# EAGLE design HV Board rev10 (EAGLE 9.2.2)
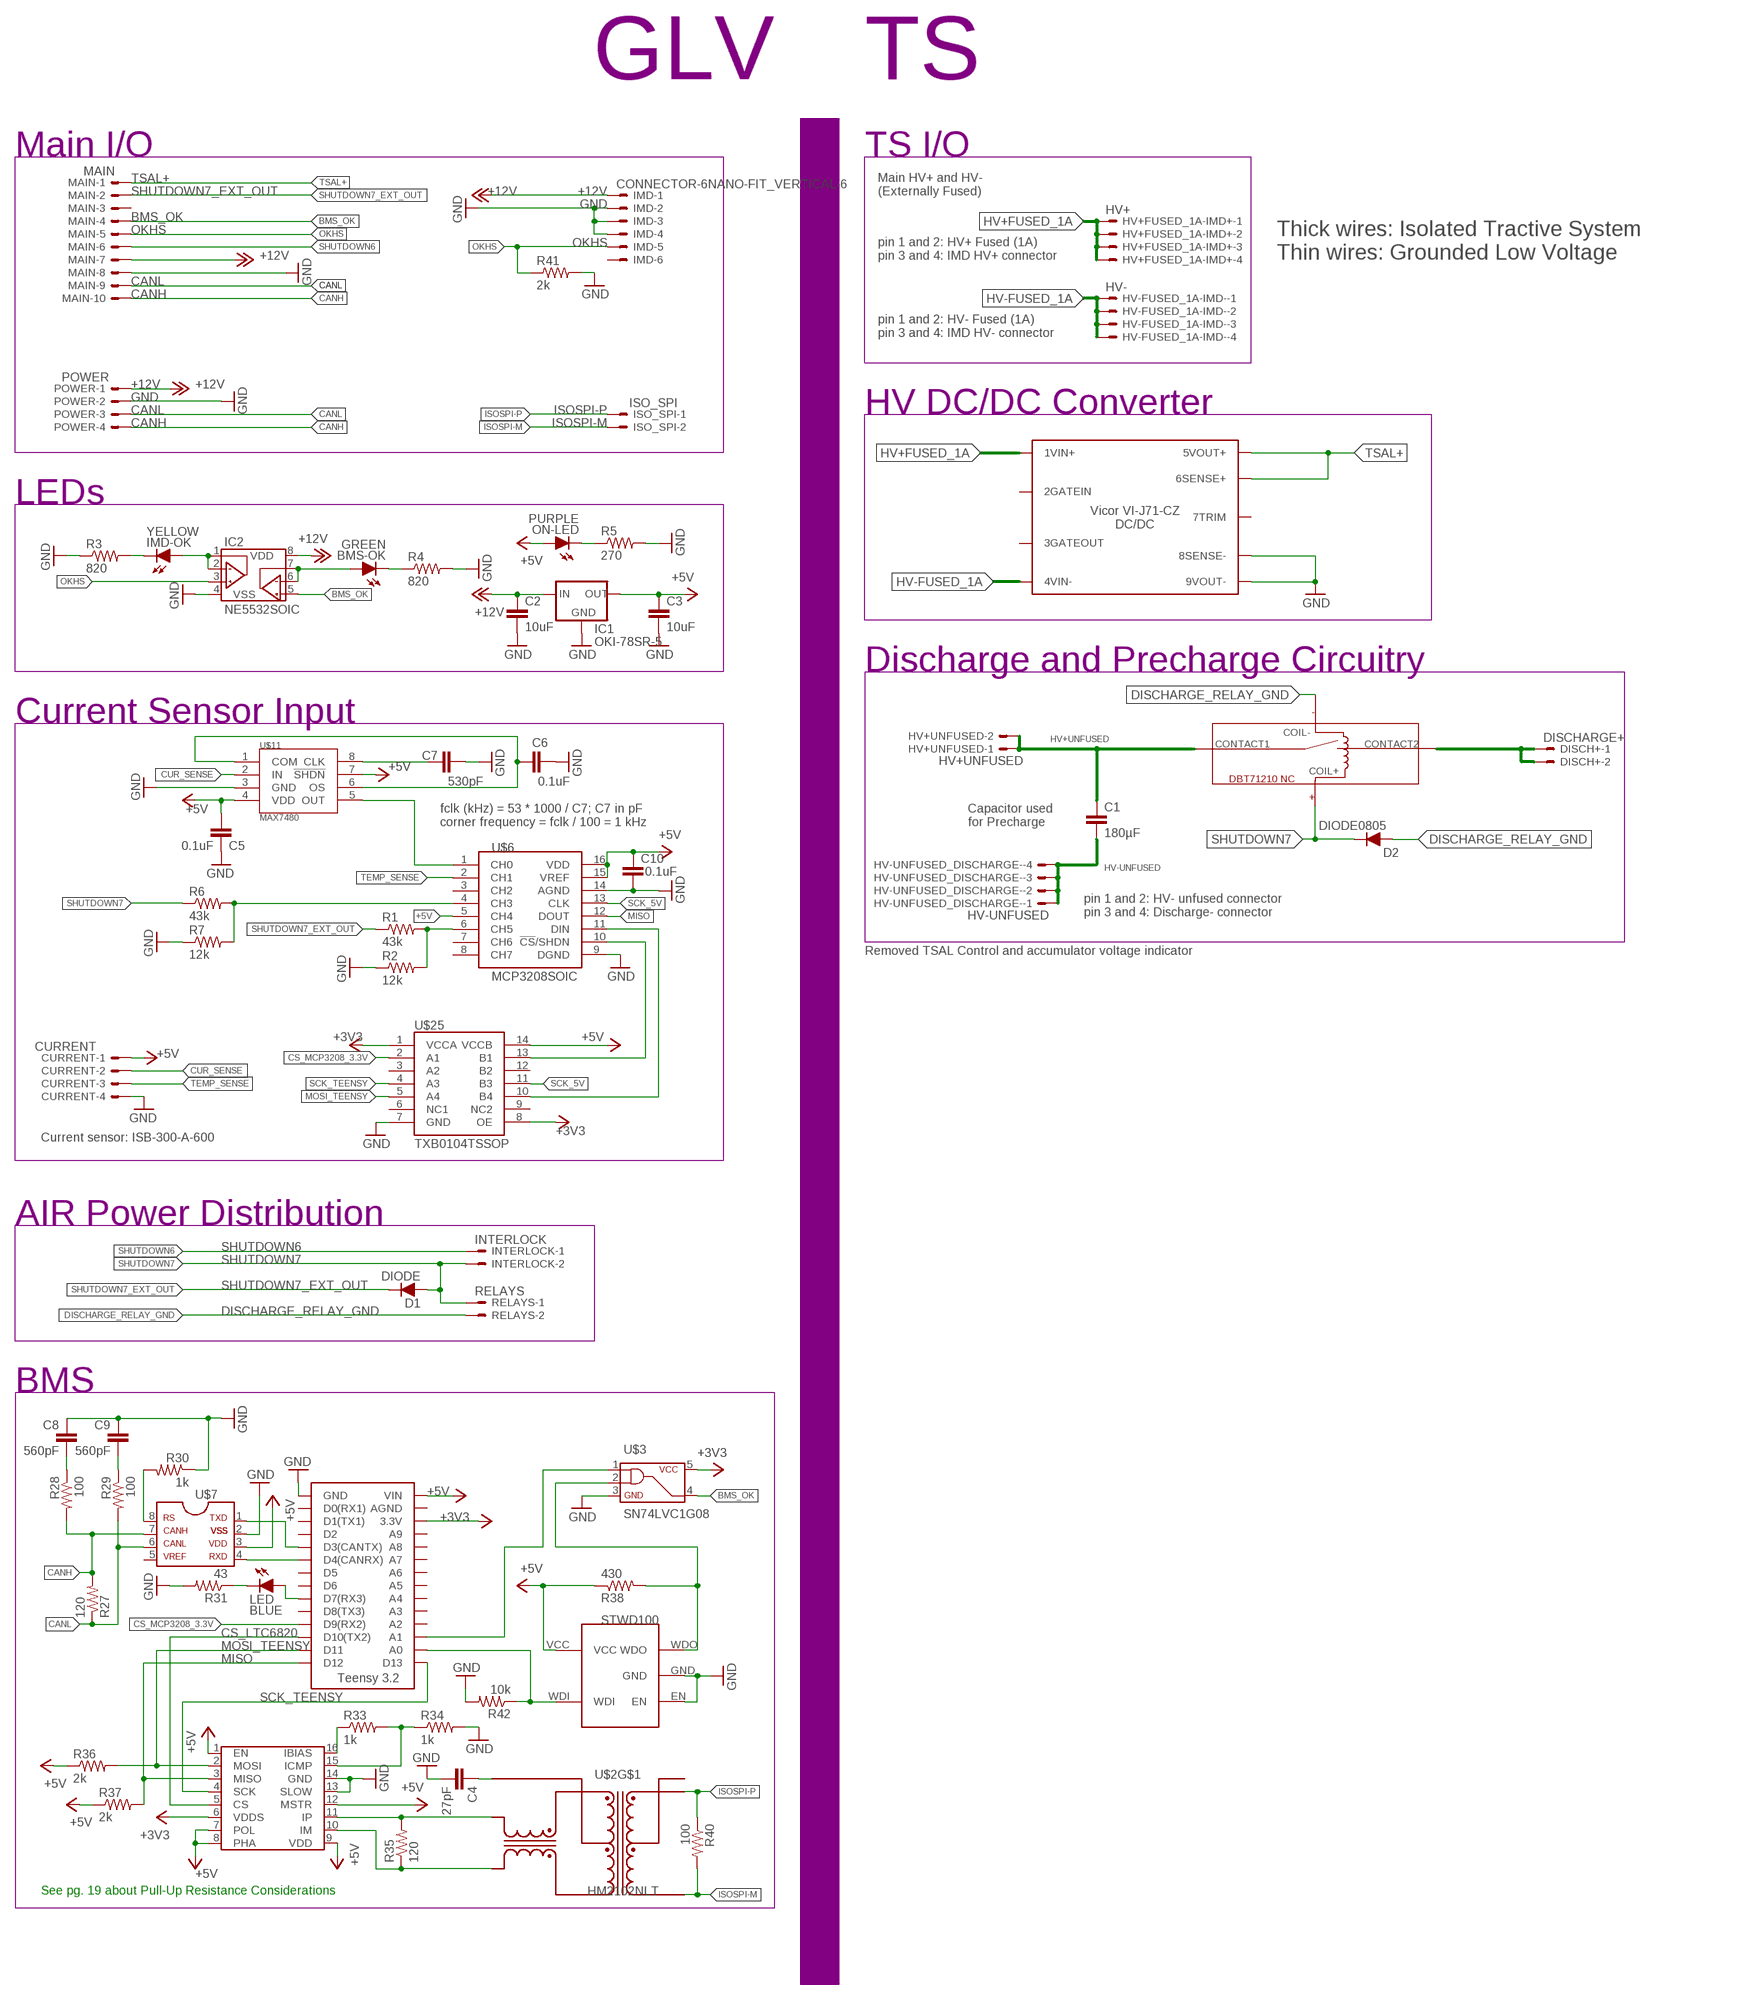
[diagram p0: schematic, sheet 1]

## Parts
BMS-OK  GREEN  LED-0805  [LED-805]
C1  180µF  CAP  [LLS2V221MELZ]
C2  10uF  CAP0805  [0805]
C3  10uF  CAP0805  [0805]
C4  27pF  CAP0805  [0805]
C5  0.1uF  CAP0805  [0805]
C6  0.1uF  CAP0805  [0805]
C7  530pF  CAP0805  [0805]
C8  560pF  CAP0805  [0805]
C9  560pF  CAP0805  [0805]
C10  0.1uF  CAP0805  [0805]
CURRENT  CURRENT  CONNECTOR-4NANO-FIT-VERTICAL-4  [NANO-FIT_VERTICAL-4]
D1  DIODE  DIODEDO-41  [DO-41]
D2  DIODE0805  [0805_D]
DISCH+  DISCHARGE+  CONNECTOR-2NANO-FIT_VERTICAL-2  [NANO-FIT_VERTICAL-2]
HV+FUSED_1A-IMD+  HV+  CONNECTOR-4NANO-FIT-VERTICAL-4  [NANO-FIT_VERTICAL-4]
HV+UNFUSED  HV+UNFUSED  CONNECTOR-2NANO-FIT_VERTICAL-2  [NANO-FIT_VERTICAL-2]
HV-FUSED_1A-IMD-  HV-  CONNECTOR-4NANO-FIT-VERTICAL-4  [NANO-FIT_VERTICAL-4]
HV-UNFUSED_DISCHARGE-  HV-UNFUSED  CONNECTOR-4NANO-FIT-VERTICAL-4  [NANO-FIT_VERTICAL-4]
IC1  OKI-78SR-5  [OKI-78SR]
IC2  NE5532SOIC  [SOIC-08]
IMD  CONNECTOR-6NANO-FIT_VERTICAL-6  [NANO-FIT_VERTICAL-6]
IMD-OK  YELLOW  LED-0805  [LED-805]
INTERLOCK  INTERLOCK  CONNECTOR-2NANO-FIT_VERTICAL-2  [NANO-FIT_VERTICAL-2]
ISO_SPI  ISO_SPI  CONNECTOR-2NANO-FIT_VERTICAL-2  [NANO-FIT_VERTICAL-2]
LED  BLUE  LED-0805  [LED-805]
MAIN  MAIN  CONNECTOR-10NANO-FIT_VERTICAL-10  [NANO-FIT_VERTICAL-10]
ON-LED  PURPLE  LED-0805  [LED-805]
POWER  POWER  CONNECTOR-4NANO-FIT-VERTICAL-4  [NANO-FIT_VERTICAL-4]
R1  43k  RESISTOR0805-RES  [0805]
R2  12k  RESISTOR0805-RES  [0805]
R3  820  RESISTOR0805-RES  [0805]
R4  820  RESISTOR0805-RES  [0805]
R5  270  RESISTOR0805-RES  [0805]
R6  43k  RESISTOR0805-RES  [0805]
R7  12k  RESISTOR0805-RES  [0805]
R27  120  RESISTOR0805-RES  [0805]
R28  100  RESISTOR0805-RES  [0805]
R29  100  RESISTOR0805-RES  [0805]
R30  1k  RESISTOR0805-RES  [0805]
R31  43  RESISTOR0805-RES  [0805]
R33  1k  RESISTOR0805-RES  [0805]
R34  1k  RESISTOR0805-RES  [0805]
R35  120  RESISTOR0805-RES  [0805]
R36  2k  RESISTOR0805-RES  [0805]
R37  2k  RESISTOR0805-RES  [0805]
R38  430  RESISTOR0805-RES  [0805]
R40  100  RESISTOR0805-RES  [0805]
R41  2k  RESISTOR0805-RES  [0805]
R42  10k  RESISTOR0805-RES  [0805]
RELAYS  RELAYS  CONNECTOR-2NANO-FIT_VERTICAL-2  [NANO-FIT_VERTICAL-2]
U$2  HM2102NLT  [HM2102NLT]
U$3  SN74LVC1G08  [SOT-23-5]
U$4  DBT71210  [DBT71210]
U$5  HV_DCDC_VI-J71-CZ  [HV_DCDC_VI-J71-CZ]
U$6  MCP3208SOIC  [SOIC-16]
U$7  MCP2551  [SOIC-08]
U$8  LTC6820  [MSOP-16]
U$9  TEENSY_3.2_SIMPLE  [TEENSY_3.2_SIMPLE]
U$10  STWD100  [SOT23-5]
U$11  MAX7480  [SOIC-08]
U$25  TXB0104TSSOP  [TSSOP-14]

## Nets
+3V3: U$3.5 U$8.6(VDDS) U$9.3.3V U$25.1(VCCA) U$25.8(OE)
+5V: C3.1 C5.1 C10.1 CURRENT.P$1 IC1.3(OUT) ON-LED.A R36.1 R37.1 R38.1 U$6.5(CH4) U$6.15(VREF) U$6.16(VDD) U$7.3 U$8.1(EN) U$8.7(POL) U$8.8(PHA) U$8.9(VDD) U$8.12(MSTR) U$9.VIN U$10.VCC U$11.4(VDD) U$25.14(VCCB)
+12V: C2.1 IC1.1(IN) IC2.8(VDD) IMD.P$1 MAIN.P$7 POWER.P$1
BMS_OK: IC2.5(VINB+) MAIN.P$4 U$3.4
CANH: MAIN.P$10 POWER.P$4 R27.2 R28.2 U$7.7
CANL: MAIN.P$9 POWER.P$3 R27.1 R29.2 U$7.6
CS_LTC6820: U$8.5(CS) U$9.D10(TX2)
CS_MCP3208_3.3V: U$9.D9(RX2) U$25.2(A1)
CUR_SENSE: CURRENT.P$2 U$11.2(IN)
DISCHARGE_RELAY_GND: D2.A RELAYS.P$2 U$4.COIL-
GND: C2.2 C3.2 C4.2 C5.2 C6.2 C7.2 C8.1 C9.1 C10.2 CURRENT.P$4 IC1.2(GND) IC2.4(VSS) IMD.P$2 IMD.P$3 IMD.P$4 MAIN.P$8 POWER.P$2 R2.1 R3.1 R4.2 R5.2 R7.1 R30.1 R31.2 R34.2 R41.2 R42.2 U$3.3 U$5.8SENSE- U$5.9VOUT- U$6.9(DGND) U$6.14(AGND) U$7.2 U$8.13(SLOW) U$8.14(GND) U$9.GND U$10.EN U$10.GND U$11.3(GND) U$25.7(GND)
HV+FUSED_1A [TS]: HV+FUSED_1A-IMD+.P$1 HV+FUSED_1A-IMD+.P$2 HV+FUSED_1A-IMD+.P$3 HV+FUSED_1A-IMD+.P$4 U$5.1VIN+
HV+UNFUSED [TS]: C1.P$1 HV+UNFUSED.P$1 HV+UNFUSED.P$2 U$4.CONTACT1
HV+UNFUSED_FSAE_DISCHARGE [TS]: DISCH+.P$1 DISCH+.P$2 U$4.CONTACT2
HV-FUSED_1A [TS]: HV-FUSED_1A-IMD-.P$1 HV-FUSED_1A-IMD-.P$2 HV-FUSED_1A-IMD-.P$3 HV-FUSED_1A-IMD-.P$4 U$5.4VIN-
HV-UNFUSED [TS]: C1.P$2 HV-UNFUSED_DISCHARGE-.P$1 HV-UNFUSED_DISCHARGE-.P$2 HV-UNFUSED_DISCHARGE-.P$3 HV-UNFUSED_DISCHARGE-.P$4
IM: R35.1 U$2.P$10(TD-) U$8.10(IM)
IP: R35.2 U$2.P$12(TD+) U$8.11(IP)
ISOSPI-M [ISO_SPI]: ISO_SPI.P$2 R40.2 U$2.P$3(MX-)
ISOSPI-P [ISO_SPI]: ISO_SPI.P$1 R40.1 U$2.P$1(MX+)
MISO: R37.2 U$6.12(DOUT) U$8.3(MISO) U$9.D12
MOSI_5V: U$6.11(DIN) U$25.10(B4)
MOSI_TEENSY: R36.2 U$8.2(MOSI) U$9.D11 U$25.5(A4)
N$1: U$6.1(CH0) U$11.5(OUT)
N$2: C6.1 U$11.1(COM) U$11.6(OS)
N$3: ON-LED.C R5.1
N$4: C7.1 U$11.8(CLK)
N$7: U$6.10(!CS!/SHDN) U$25.13(B1)
N$8: U$11.7(!SHDN) ; supply symbol labelled +5V
N$9: R6.2 R7.2 U$6.4(CH3)
N$24: R1.2 R2.2 U$6.6(CH5)
N$25: U$7.1 U$9.D3(CANTX)
N$26: R30.2 U$7.8
N$27: C8.2 R28.1
N$28: C9.2 R29.1
N$29: LED.C R31.1
N$31: R33.1 U$8.16(IBIAS)
N$32: R33.2 R34.1 U$8.15(ICMP)
N$35: C4.1 U$2.P$11(TCT)
N$36: U$7.4 U$9.D4(CANRX)
N$37: LED.A U$9.D7(RX3)
N$38: R38.2 U$3.2 U$10.WDO
N$40: U$3.1 U$9.A1
N$42: IC2.1(VOUTA) IC2.2(VINA-) IMD-OK.A
N$43: BMS-OK.A IC2.6(VINB-) IC2.7(VOUTB)
N$44: BMS-OK.C R4.1
N$45: IMD-OK.C R3.2
N$50: R42.1 U$9.A0 U$10.WDI
OKHS: IC2.3(VINA+) IMD.P$5 MAIN.P$5 R41.1
SCK_5V: U$6.13(CLK) U$25.11(B3)
SCK_TEENSY: U$8.4(SCK) U$9.D13 U$25.4(A3)
SHUTDOWN6: INTERLOCK.P$1 MAIN.P$6
SHUTDOWN7: D1.A D2.C INTERLOCK.P$2 R6.1 RELAYS.P$1 U$4.COIL+
SHUTDOWN7_EXT_OUT: D1.C MAIN.P$2 R1.1
TEMP_SENSE: CURRENT.P$3 U$6.2(CH1)
TSAL+: MAIN.P$1 U$5.5VOUT+ U$5.6SENSE+
Unconnected: IMD.P$6 MAIN.P$3 U$2.P$2(MCT) U$2.P$4(MX+) U$2.P$5(MCT) U$2.P$6(MX-) U$2.P$7(TD-) U$2.P$8(TCT) U$2.P$9(TD+) U$5.2GATEIN U$5.3GATEOUT U$5.7TRIM U$6.3(CH2) U$6.7(CH6) U$6.8(CH7) U$7.5 U$9.A2 U$9.A3 U$9.A4 U$9.A5 U$9.A6 U$9.A7 U$9.A8 U$9.A9 U$9.AGND U$9.D0(RX1) U$9.D1(TX1) U$9.D2 U$9.D5 U$9.D6 U$9.D8(TX3) U$25.3(A2) U$25.6(NC1) U$25.9(NC2) U$25.12(B2)

## Notes on the sheet
- GLV
- TS
- Main I/O | TS I/O
- Main HV+ and HV-
  (Externally Fused)
- pin 1 and 2: HV+ Fused (1A)
  pin 3 and 4: IMD HV+ connector
- Thick wires: Isolated Tractive System
  Thin wires: Grounded Low Voltage
- pin 1 and 2: HV- Fused (1A)
  pin 3 and 4: IMD HV- connector
- HV DC/DC Converter
- LEDs
- Discharge and Precharge Circuitry
- Current Sensor Input
- fclk (kHz) = 53 * 1000 / C7; C7 in pF
  corner frequency = fclk / 100 = 1 kHz
- Capacitor used
  for Precharge
- pin 1 and 2: HV- unfused connector
  pin 3 and 4: Discharge- connector
- Removed TSAL Control and accumulator voltage indicator
- Current sensor: ISB-300-A-600
- AIR Power Distribution
- BMS
- See pg. 19 about Pull-Up Resistance Considerations

## Library data of the parts
BMS-OK IMD-OK LED ON-LED = HyTechDevices:LED: Light Emitting Diode (LED) Source: Dangerous Prototypes Eagle Library <https://github.com/DangerousPrototypes/Eagle_Part_Library>
C1-C10 = HyTechDevices:CAP: Capacitor Standard 0603 ceramic capacitor, and 0.1" leaded capacitor.
CURRENT HV+FUSED_1A-IMD+ HV-FUSED_1A-IMD- HV-UNFUSED_DISCHARGE- POWER = HyTechDevices:CONNECTOR-4: Mini-Fit Junior connector 4 pole Source: http://www.molex.com
D1 D2 = HyTechDevices:DIODE: DIODE general purpose rectifier
DISCH+ HV+UNFUSED INTERLOCK ISO_SPI RELAYS = HyTechDevices:CONNECTOR-2: Mini-Fit Junior connector 2 pole Source: http://www.molex.com
IC1 = HyTechDevices:OKI-78SR-5: Murata OKI-78SR 5V 1.5A Non-Isolated Switching Regulator DC/DC - Datasheet <https://power.murata.com/data/power/oki-78sr.pdf>
IC2 = HyTechDevices:NE5532: TI NE5532 Dual Channel Op Amp
IMD = HyTechDevices:CONNECTOR-6: Mini-Fit Junior connector 6 pole Source: http://www.molex.com
MAIN = HyTechDevices:CONNECTOR-10: Mini-Fit Junior connector 10 pole Source: http://www.molex.com
R1-R7 R27-R31 R33-R38 R40-R42 = HyTechDevices:RESISTOR: Resistor Basic schematic elements and footprints for 0603, 1206, and PTH resistors.
U$2 = HyTechDevices:HM2102NLT: 2 Channel SMT Transformer Turns ratio: 1CT: 1CT Isolation Voltage: 4300 VDC Inductance: 150 uH Leakage Inductance: 0.50 uH max DataSheet <https://www.mouser.com/datasheet/2/336/HM2102NL-1218600.pdf>
U$3 = HyTechDevices:SN74LVC1G08: TI SN74LVC1G08 SINGLE 2-INPUT POSITIVE-AND GATE Datasheet <http://www.ti.com/lit/ds/sces556f/sces556f.pdf>
U$4 = HyTechDevices:DBT71210: DBT71210 Reed Relay Form B (Standard normally closed), switch 12V
U$5 = HyTechDevices:HV_DCDC_VI-J71-CZ: Vicor-Corporation VI-J71-CZ Product Page <https://www.digikey.com/product-detail/en/vicor-corporation/VI-J71-CZ/1102-1486-ND/2996194> Datasheet <http://cdn.vicorpower.com/documents/datasheets/ds_vi-j00.pdf>
U$6 = HyTechDevices:MCP3208: Analog to Digital Converter
U$7 = HyTechDevices:MCP2551: MCP2551 High-Speed CAN Transceiver Product Webpage <https://www.microchip.com/wwwproducts/en/MCP2551> Datasheet <http://ww1.microchip.com/downloads/en/DeviceDoc/21667f.pdf> This device is outdated It is replaced by MCP2561. Comparison Page <https://www.microchip.com/wwwproducts/ProductCompare/MCP2551/MCP2561> Product Webpage <https://www.microchip.com/wwwproducts/en/MCP2561> Datasheet <http://ww1.microchip.com/downloads/en/DeviceDoc/20005167C.pdf>
U$8 = HyTechDevices:LTC6820: Linear Technology isoSPI Isolated Communications Interface Datasheet <http://cds.linear.com/docs/en/datasheet/6820fb.pdf>
U$9 = HyTechDevices:TEENSY_3.2_SIMPLE: Simple version of the Teensy 3.2 board that only uses the 2 main rows of pins, not the inner pins or the pins opposite the usb port.
U$10 = HyTechDevices:STWD100: STWD100 Watchdog timer
U$11 = HyTechDevices:MAX7480: 8th-order lowpass butterworth filter
U$25 = HyTechDevices:TXB0104: Texas Instruments TXB0104 4-channel low voltage to high voltage Logic Level Shifter. Minimum input voltage level 1.8V. Maximum output voltage level 5.5V.

## Net classes
1 TS: clearance 8.5 mm to class 0
2 ISO_SPI: clearance 8.5 mm to class 0, clearance 8.5 mm to class 1

## Board
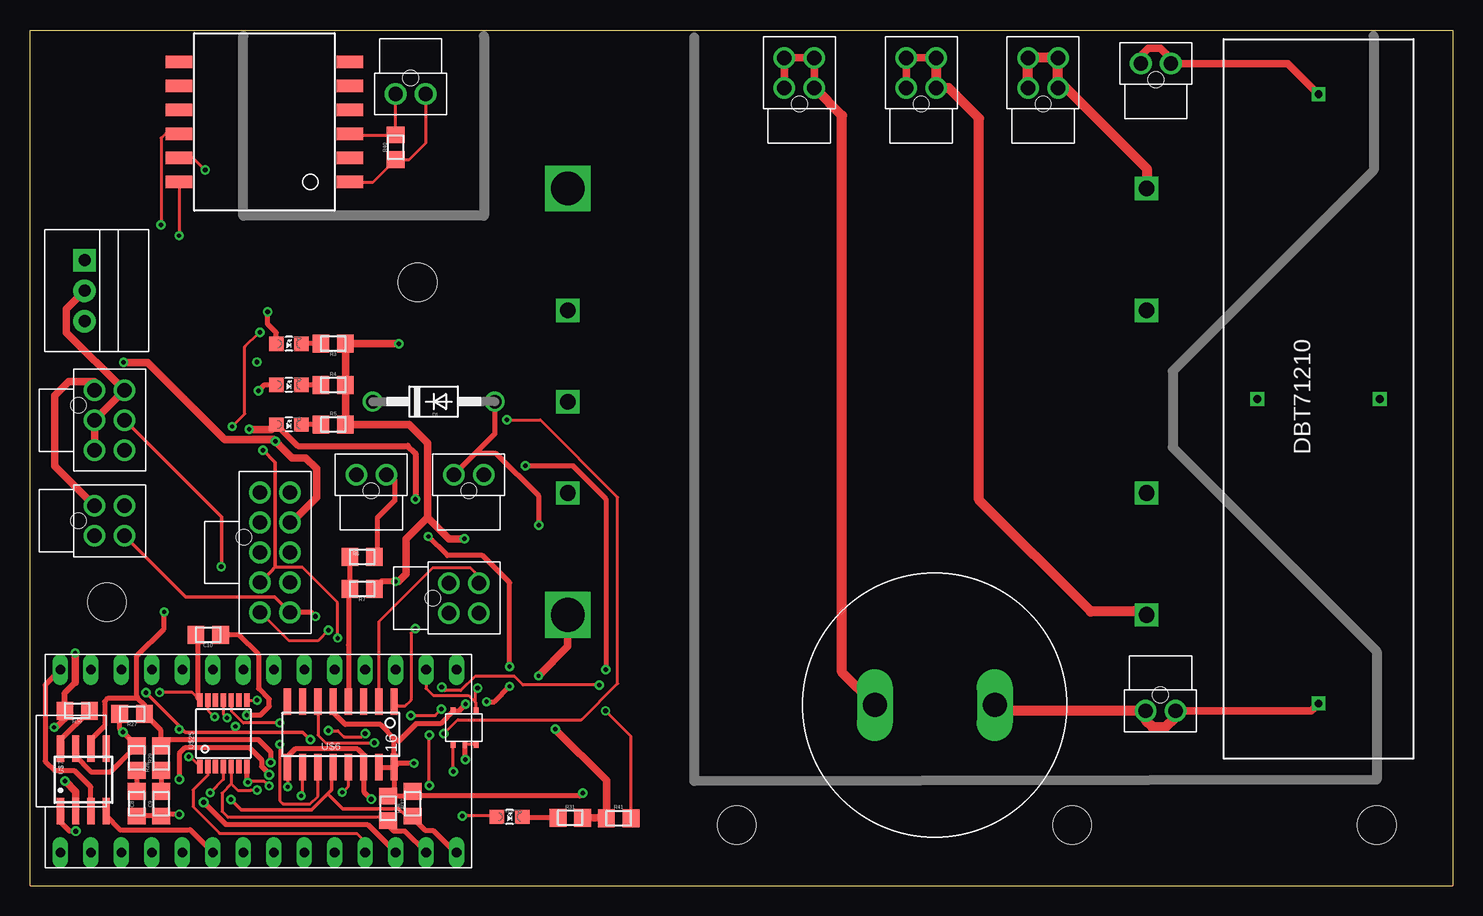
[diagram p1: board, top side]
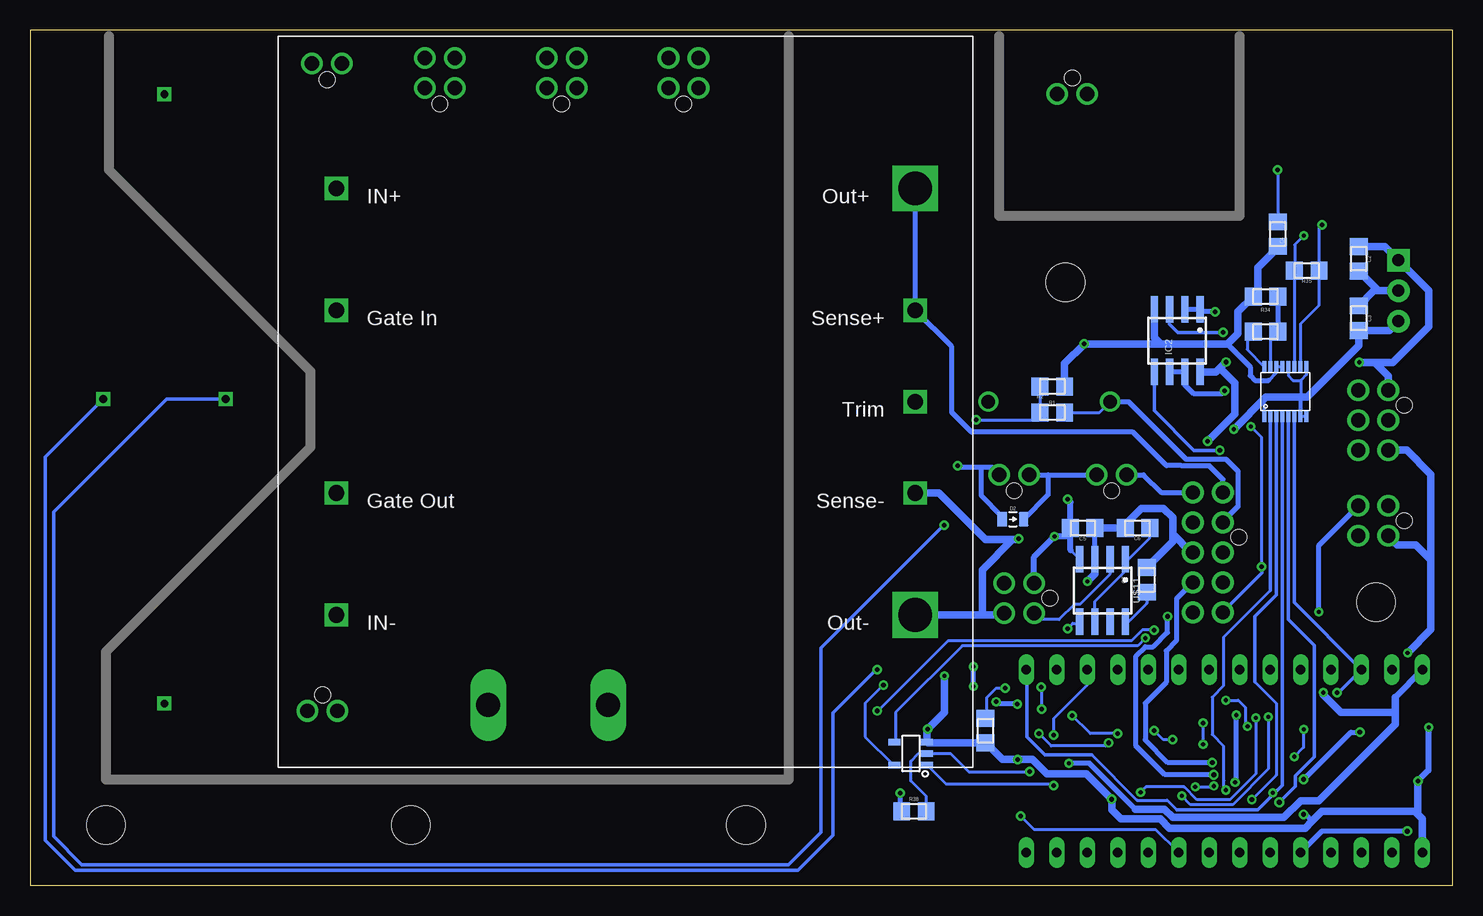
[diagram p2: board, bottom side, seen from below]

Size 118.62 x 71.37 mm. Coordinates in mm from the lower left corner, seen from the top.
Outline: 0,0 118.62,0 118.62,71.37 0,71.37 0,0
Copper layers (1*16): Top 0.035mm / dielectric 1.5mm / Bottom 0.035mm
Design rules "DRC Advanced Circuits": minimum track width 6mil, minimum drill 10mil, track to track 6mil, track to pad 6mil, pad to pad 6mil, via to via 6mil, smd to smd 6mil, copper to edge 40mil, drill to drill 6mil, minimum pad ring 10mil, minimum via ring 8mil, stop-mask expansion 4mil, vias tented up to drill 0mil, thermal gap 10mil
Holes 3.2 mm at 86.87,5.08 6.4,23.67 112.27,5.08 58.93,5.08 32.31,50.34

### Footprints (pad centres in the part's own frame; a part is rotated, then mirrored left to right if it is on the bottom)
LED-805 = smd 1.2 x 1.2: A 0,-1.05; C 0,1.05
LLS2V221MELZ = drill 2 long: P$1 -5,0; P$2 5,0
0805 = smd 1.4 x 1.5: 1 -1.025,0; 2 1.025,0
NANO-FIT_VERTICAL-4 = drill 1.2: P$1 -1.25,0; P$2 1.25,0; P$3 -1.25,2.5; P$4 1.25,2.5 | hole 1.3: 0,-1.34
DO-41 = drill 1.118: A 5.08,0; C -5.08,0
0805_D = smd 0.8 x 1.2: A -0.9,0; C 0.9,0
NANO-FIT_VERTICAL-2 = drill 1.2: P$1 -1.25,0; P$2 1.25,0 | hole 1.3: 0,-1.34
OKI-78SR = drill 1 pad 1.88 square: 1 -2.54,0 | drill 1 pad 1.88: 2 0,0; 3 2.54,0
SOIC-08 = smd 0.6 x 2.2: 1 -1.905,-2.6; 2 -0.635,-2.6; 3 0.635,-2.6; 4 1.905,-2.6; 5 1.905,2.6; 6 0.635,2.6; 7 -0.635,2.6; 8 -1.905,2.6
NANO-FIT_VERTICAL-6 = drill 1.2: P$1 -2.5,0; P$2 0,0; P$3 2.5,0; P$4 -2.5,2.5; P$5 0,2.5; P$6 2.5,2.5 | hole 1.3: -1.25,-1.34
NANO-FIT_VERTICAL-10 = drill 1.2: P$1 -5,0; P$2 -2.5,0; P$3 0,0; P$4 2.5,0; P$5 5,0; P$6 -5,2.5; P$7 -2.5,2.5; P$8 0,2.5; P$9 2.5,2.5; P$10 5,2.5 | hole 1.3: -1.27,-1.34
HM2102NLT = smd 1.067 x 2.184: P$1 0,0; P$2 2,0; P$3 4,0; P$4 6,0; P$5 8,0; P$6 10,0; P$7 10,14.25; P$8 8,14.25; P$9 6,14.25; P$10 4,14.25; P$11 2,14.25; P$12 0,14.25
SOT-23-5 = smd 1 x 0.55: 1 -1.35,0.95; 2 -1.35,0; 3 -1.35,-0.95; 4 1.35,-0.95; 5 1.35,0.95
DBT71210 = drill 0.65 square: COIL+ 30,-13; COIL- 30,-2.8; CONTACT1 55.4,-7.9; CONTACT2 4.6,-7.9
HV_DCDC_VI-J71-CZ = drill 1.3 square: 1VIN+ 5.08,-12.7; 2GATEIN 5.08,-22.86; 3GATEOUT 5.08,-38.1; 4VIN- 5.08,-48.26; 6SENSE+ 53.34,-22.86; 7TRIM 53.34,-30.48; 8SENSE- 53.34,-38.1 | drill 2.8 square: 5VOUT+ 53.34,-12.7; 9VOUT- 53.34,-48.26
SOIC-16 = smd 0.6 x 2.2: 1 -4.445,-2.794; 2 -3.175,-2.794; 3 -1.905,-2.794; 4 -0.635,-2.794; 5 0.635,-2.794; 6 1.905,-2.794; 7 3.175,-2.794; 8 4.445,-2.794; 9 4.445,2.667; 10 3.175,2.667; 11 1.905,2.667; 12 0.635,2.667; 13 -0.635,2.667; 14 -1.905,2.667; 15 -3.175,2.667; 16 -4.445,2.667
MSOP-16 = smd 0.305 x 0.889: 1 -0.1,-0.5; 2 0.4,-0.5; 3 0.9,-0.5; 4 1.4,-0.5; 5 1.9,-0.5; 6 2.4,-0.5; 7 2.9,-0.5; 8 3.4,-0.5; 9 3.4,3.7; 10 2.9,3.7; 11 2.4,3.7; 12 1.9,3.7; 13 1.4,3.7; 14 0.9,3.7; 15 0.4,3.7; 16 -0.1,3.7
TEENSY_3.2_SIMPLE = drill 0.8 long: 3.3V 16.51,29.21; A0 16.51,3.81; A1 16.51,6.35; A2 16.51,8.89; A3 16.51,11.43; A4 16.51,13.97; A5 16.51,16.51; A6 16.51,19.05; A7 16.51,21.59; A8 16.51,24.13; A9 16.51,26.67; AGND 16.51,31.75; D0(RX1) 1.27,31.75; D1(TX1) 1.27,29.21; D2 1.27,26.67; D3(CANTX) 1.27,24.13; D4(CANRX) 1.27,21.59; D5 1.27,19.05; D6 1.27,16.51; D7(RX3) 1.27,13.97; D8(TX3) 1.27,11.43; D9(RX2) 1.27,8.89; D10(TX2) 1.27,6.35; D11 1.27,3.81; D12 1.27,1.27; D13 16.51,1.27; GND 1.27,34.29; VIN 16.51,34.29
SOT23-5 = smd 0.61 x 0.406: EN -2.794,0; GND -2.794,0.94; VCC 0,1.905; WDI 0,0; WDO -2.794,1.905
TSSOP-14 = smd 0.45 x 1.1: 1 -1.958,-2.618; 2 -1.308,-2.618; 3 -0.657,-2.618; 4 -0.007,-2.618; 5 0.642,-2.618; 6 1.292,-2.618; 7 1.942,-2.618; 8 1.942,2.918; 9 1.292,2.918; 10 0.642,2.918; 11 -0.007,2.918; 12 -0.657,2.918; 13 -1.308,2.918; 14 -1.958,2.918

### Placement (x,y rotation side)
BMS-OK  21.59,41.78 270 top
C1  75.43,15.1 180 top
C2  7.85,52.3 270 bottom
C3  7.85,47.35 90 bottom
C4  14.61,54.36 270 bottom
C5  30.86,29.84 0 bottom
C6  26.29,29.84 180 bottom
C7  25.53,25.53 90 bottom
C8  8.89,6.86 90 top
C9  10.92,6.86 90 top
C10  14.86,20.95 0 top
CURRENT  34.92,24 270 top
D1  33.66,40.39 0 top
D2  TS4148 RYG  [0805_D]  36.68,30.58 0 bottom
DISCH+  93.85,68.58 0 top
HV+FUSED_1A-IMD+  84.45,66.55 0 top
HV+UNFUSED  94.23,14.61 180 top
HV-FUSED_1A-IMD-  74.3,66.55 0 top
HV-UNFUSED_DISCHARGE-  64.14,66.55 0 top
IC1  4.55,49.63 270 top
IC2  22.99,45.47 180 bottom
IMD  5.38,38.84 270 top
IMD-OK  21.59,45.21 270 top
INTERLOCK  28.45,34.29 0 top
ISO_SPI  31.73,66.04 180 top
LED  39.98,5.77 270 top
MAIN  19.18,27.81 270 top
ON-LED  21.59,38.48 270 top
POWER  5.38,30.45 270 top
R1  33.4,39.5 180 bottom
R2  33.4,41.66 180 bottom
R3  25.27,45.21 180 top
R4  25.27,41.78 0 top
R5  25.27,38.48 0 top
R6  27.69,27.43 180 top
R7  27.69,24.77 180 top
R27  8.51,14.35 180 top
R28  8.89,10.67 90 top
R29  10.92,10.67 90 top
R30  3.94,14.61 0 top
R31  45.03,5.69 0 top
R33  15.62,46.23 0 bottom
R34  15.62,49.15 180 bottom
R35  12.19,51.31 180 bottom
R36  29.84,6.48 270 top
R37  31.88,6.86 270 top
R38  44.93,6.22 0 bottom
R40  30.48,61.59 90 top
R41  49.07,5.66 180 top
R42  38.96,12.95 270 bottom
RELAYS  36.58,34.29 0 top
U$2  26.67,58.71 90 top
U$3  45.19,11.05 180 bottom
U$4  115.32,70.61 270 top
U$5  98.17,70.87 0 bottom
U$6  25.91,12.57 180 top
U$7  4.45,8.86 0 top
U$8  15.62,39.62 0 bottom
U$9  36.83,1.52 90 top
U$10  37.19,14.61 90 top
U$11  29.21,24.64 180 bottom
U$25  16.13,12.57 0 top

### Tracks (layer width: path | path; a pad name or v marks a point on that pad's centre or on a via)
+3V3  (via drill 0.35, 0.38)
  Top 0.254: v24.89,12.95 25.65,12.95 26.16,12.45 27.67,12.45 v27.94,12.71 | v31.75,14.22 33.78,14.22 v34.29,14.73 | v34.31,16.59 34.59,16.31 35.92,16.31 37.08,17.48 40.39,17.48 41.1,16.76 v47.47,16.76 | U$25.1 13.34,10.78 v13.22,10.78 | 12.57,13.21 12.57,13.18 v12.44,13.06 | 17.02,12.83 17.02,13.21 v17.12,13.31 | U$25.8 v18.92,15.49
  Top 0.305: v9.65,16.13 12.57,13.21 12.95,12.83 17.02,12.83 22.73,12.83 v23.37,12.19
  Bottom 0.254: v23.37,12.19 24.13,12.19 v24.89,12.95 | v27.94,12.71 30.24,12.71 v31.75,14.22 | v34.31,16.59 34.31,14.76 v34.29,14.73 | v47.47,16.76 49,15.24 49,12.45 46.65,10.1 U$3.5 | v13.22,10.78 12.46,11.55 12.46,12.41 12.44,12.42 v12.44,13.06 | v17.12,13.31 17.27,13.46 17.27,14.86 17.91,15.49 v18.92,15.49
  Bottom 0.305: v9.65,16.13 9.53,16.13 U$9.3.3V 13.22,23.64 U$8.6
+5V  (via drill 0.35, 0.38)
  Top 0.254: U$25.14 13.53,16.13 v10.79,16.13
  Top 0.406: U$7.3 5.08,8.26 3.74,9.59 2.09,9.59 1.27,10.41 1.27,16.76 U$9.VIN | U$6.5 25.27,14.48 26.29,13.46 29.21,13.46 30.48,12.19 | v46.08,7.75 45.85,7.52 32.24,7.52 R37.1 31.5,7.5 R36.1 30.35,8.01 U$6.16 | C10.1 13.96,20.83 13.96,15.7 U$25.14 | U$6.15 U$6.16 | U$6.16 30.35,12.06 30.48,12.19 | 30.48,12.19 30.53,12.24 30.71,12.06 32.18,13.54 34.21,13.54 U$10.VCC 35.76,14.61 v36.32,15.16 | v32,10.23 30.68,10.23 U$6.16 | v38.08,15.37 38.71,15.37 v39.98,16.64 | v39.98,18.29 39.98,25.3 37.72,27.56 34.8,27.56 v33.2,29.15
  Top 0.508: ON-LED.A 22.32,36.7 31.5,36.7 32.13,36.07 v32.13,32.26
  Top 0.61: v18.27,38.08 20.14,38.08 ON-LED.A
  Bottom 0.254: U$8.8 U$8.7 | 12.7,42.16 12.7,39.15 U$8.7 | U$11.4 31.89,28.01 | U$8.9 12.22,42.64 12.7,42.16 | U$8.12 13.72,42.55 13.34,42.16 12.7,42.16 | U$8.7 12.72,40.66 12.83,40.77 | U$8.1 15.72,40.63 15.58,40.77
  Bottom 0.406: R38.1 46.08,6.34 v46.08,7.75 | 26.48,6.41 30.3,10.23 v32,10.23 | v36.32,15.16 36.37,15.21 37.92,15.21 v38.08,15.37 | v39.98,16.64 v39.98,18.29
  Bottom 0.508: v32.13,32.26 31.89,32.01 C5.1 31.89,29.15 | 31.89,28.01 31.89,29.15 | 31.89,29.15 v33.2,29.15 34.92,27.43 CURRENT.P$1 | 4.83,15.75 U$9.VIN
  Bottom 0.61: 26.48,6.41 24.07,6.41 23.37,5.71 14.1,5.71 12.7,7.11 11.18,7.11 4.83,13.46 4.83,14.48 | 4.83,14.48 4.83,15.75 | v10.79,16.13 10.79,15.94 9.33,14.48 4.83,14.48 | IC1.3 5.32,46.32 C3.1 7.85,45.05 12.13,40.77 12.83,40.77 15.58,40.77 v18.27,38.08
+12V  (via drill 0.35, 0.38)
  Top 0.61: MAIN.P$7 21.8,30.31 23.88,32.38 23.88,34.8 22.99,35.69 21.84,35.69 v20.45,37.08 20.32,37.21 16.23,37.21 9.8,43.64 7.82,43.64 v7.8,43.66 | POWER.P$1 2.07,35.02 2.07,40.9 3.23,42.06 5.34,42.06 5.34,41.38 IMD.P$1
  Bottom 0.61: IC2.8 19.75,42.87 19.43,43.18 | 19.43,43.18 v18.92,43.69 | 19.43,43.18 18.16,41.92 18.16,39.37 v20.45,37.08 | C2.1 5.7,53.32 IC1.1 2.01,49.63 2.01,46.66 5,43.66 v7.8,43.66 6.53,43.66 5.38,42.52 IMD.P$1
BMS_OK  (via drill 0.35, 0.38)
  Top 0.254: 20.11,26.25 20.41,26.54 22.73,26.54 25.64,23.64 v25.64,20.67
  Top 0.305: MAIN.P$4 20.11,26.25 20.45,26.58 20.45,35.33 v19.43,36.34
  Bottom 0.254: U$3.4 46.46,12.08 46.46,14.48 40.89,20.04 26.27,20.04 v25.64,20.67
  Bottom 0.305: IC2.5 24.89,39.62 21.59,36.32 19.45,36.32 v19.43,36.34
CANH  (via drill 0.38, 0.4)
  Top 0.305: MAIN.P$10 20.38,24.11 12.98,24.11 POWER.P$4
  Top 0.406: R27.2 7.48,13.1 v7.75,12.83 R28.2 7.62,10.42 7.62,10.41 6.73,9.53 5.08,9.53 3.81,10.79 U$7.7 | v23.79,22.48 23.45,22.81 MAIN.P$10 | v12.45,8.89 12.45,11.05 12.95,11.56 18.29,11.56 19.31,10.54 19.31,9.97 19.94,9.34 v19.94,9.27
  Bottom 0.406: v12.45,8.89 8.51,12.83 v7.75,12.83 | v19.94,9.27 24,9.27 26.42,11.68 26.42,19.18 25.65,19.94 24.98,19.94 23.79,21.13 v23.79,22.48
CANL  (via drill 0.35, 0.4)
  Top 0.254: 11.05,12.2 11.05,11.82 R29.2
  Top 0.406: U$7.6 5.08,12.19 6.22,13.34 6.22,15.37 6.54,15.68 8.95,15.68 | 11.05,12.2 19.04,12.2 20.07,11.17 v20.07,10.28 | R29.2 10.92,12.96 9.59,14.29 | 9.59,14.29 R27.1 | 8.95,15.68 9.59,15.04 9.59,14.29 | 8.95,15.68 8.95,15.77 8.9,15.82 8.9,19.18 11.18,21.45 v11.18,22.86
  Bottom 0.406: v20.07,10.28 23.75,10.28 25.65,12.19 25.65,15.24 23.91,16.99 23.91,19.62 23.04,20.48 23.04,23.95 MAIN.P$9 | v11.18,22.86 11.18,28.41 POWER.P$3
CS_LTC6820  (via drill 0.4)
  Top 0.406: v14.48,6.99 16.32,5.14 28.13,5.14 U$9.D10(TX2)
  Bottom 0.305: v14.48,6.99 13.15,8.31 13.15,9.18 11.56,10.78 11.56,20.07 13.72,22.23 U$8.5
CS_MCP3208_3.3V
  Top 0.254: U$25.2 14.82,9.23 13.59,8 13.59,6.6 15.81,4.38 27.24,4.38 27.94,3.68 U$9.D9(RX2)
CUR_SENSE
  Bottom 0.254: CURRENT.P$2 34.87,22.75 34.33,22.21 32.84,22.21 31.56,23.5 31.11,23.5 28.57,26.04 28.57,26.98 U$11.2
DISCHARGE_RELAY_GND  (via drill 0.38)
  Top 0.406: v41.27,35.05 45.21,35.05 48.01,32.26 v48.01,18.05
  Bottom 0.305: U$4.COIL- 117.35,35.78 117.35,3.81 114.84,1.3 54.6,1.3 51.69,4.22 51.69,14.42 48.06,18.05 v48.01,18.05
  Bottom 0.406: RELAYS.P$2 38.46,34.92 39.22,34.92 | v41.27,35.05 41.15,34.92 39.22,34.92 | D2.A 37.58,30.82 39.32,32.56 39.32,34.82 39.22,34.92
GND  (via drill 0.35, 0.38, 0.4)
  Top 0.254: U$10.EN U$10.GND | U$6.9 21.46,8.29 v21.49,8.27 | v19.94,8.34 19.69,8.59 19.66,8.59 19.52,8.73 18.07,8.73
  Top 0.406: C8.1 C9.1 11.06,5.97 v12.45,5.97 | U$6.9 21.46,10.79 22.1,11.43 27.3,11.43 27.81,10.92 U$6.14 27.81,7.87 v28.45,7.24 | U$10.GND 36.25,10.59 v36.3,10.54 | U$25.7 18.07,8.73 v18.16,8.64 | C10.2 17.4,20.95 19.05,19.3 19.05,16.47 19.94,15.58 19.94,14.99 19.2,14.25 v18.05,14.25
  Top 0.508: v2,13.23 2.21,13.23 2.91,13.94 R30.1 2.91,16.12 3.78,16.99 | v30.48,25.4 29.35,25.4 R7.1
  Top 0.61: 33.15,30.73 33.15,36.96 31.62,38.48 R5.2 R4.2 R3.1 v30.73,45.21 | IMD.P$3 IMD.P$2 IMD.P$4 7.84,41.34 3.02,46.15 3.02,48.11 IC1.2 | 3.78,16.99 v3.78,19.43 | U$7.2 3.81,7.87 v2.92,8.76 | v43.79,13.08 48.05,8.82 R41.2 48.02,5.69 R31.2 | v30.48,25.4 30.73,25.4 31.37,26.04 31.37,28.96 33.15,30.73 | U$5.9VOUT- 44.83,19.96 v42.39,17.53 | 33.15,30.73 34.92,28.96 v36.2,28.96
  Bottom 0.254: U$8.14 U$8.13 | 39.03,12 R42.2 | v21.49,8.27 20.01,8.27 v19.94,8.34
  Bottom 0.305: U$8.14 14.72,42.8 15.35,42.16
  Bottom 0.406: v12.45,5.97 12.32,5.97 11.75,5.4 | v18.16,8.64 18.05,8.74 v18.05,14.25 | U$11.3 29.84,27.25 C5.2 | 18.8,45.19 16.89,43.28 16.89,42.55 16.51,42.16 15.35,42.16
  Bottom 0.508: v2,13.23 2.06,13.18 2.06,9.63 v2.92,8.76
  Bottom 0.61: 2.92,5.97 3.18,6.22 10.92,6.22 11.75,5.4 12.32,4.83 23.62,4.83 24.38,5.59 27.69,5.59 28.45,6.35 v28.45,7.24 30.56,9.35 33.86,9.35 35.05,10.54 v36.3,10.54 37.58,10.54 39.03,12 | 36.73,28.88 38.98,28.88 42.86,32.77 U$5.8SENSE- | U$5.9VOUT- 39.24,22.61 | 39.24,22.61 37.57,22.61 CURRENT.P$4 | 39.24,22.61 39.24,26.36 36.73,28.88 | 23.37,29.34 23.37,30.73 24.13,31.5 25.96,31.5 27.31,30.15 C6.2 C5.2 | 23.37,29.34 23.37,28.71 C7.2 | 23.37,29.34 21.84,27.81 MAIN.P$8 | IMD.P$3 3.86,36.34 1.83,34.3 1.83,27.18 | v2.92,8.76 2.92,5.97 | R42.2 43.77,11.93 U$3.3 43.84,13.03 v43.79,13.08 42.39,14.48 v42.39,17.53 | 2.92,5.97 2.54,5.59 U$9.GND | IC2.4 24.89,45.72 24.36,45.19 | 24.36,45.19 18.8,45.19 17.92,46.07 17.92,47.88 R34.2 16.26,49.54 16.26,51.56 14.61,53.21 C4.2 | 24.36,45.19 30.71,45.19 v30.73,45.21 v30.73,45.2 32.38,43.56 R2.1 | v30.48,25.4 29.84,26.04 U$11.3 | C2.2 6.21,49.63 | 6.21,49.63 IC1.2 | C3.2 6.59,49.63 6.21,49.63 | v3.78,19.43 1.83,21.38 1.83,27.18 | POWER.P$2 4.63,28.45 3.1,28.45 1.83,27.18 | 36.73,28.88 36.27,28.88 v36.2,28.96
HV+FUSED_1A
  Top 0.813: HV+FUSED_1A-IMD+.P$1 HV+FUSED_1A-IMD+.P$3 HV+FUSED_1A-IMD+.P$4 HV+FUSED_1A-IMD+.P$2 86.36,66.55 93.09,59.82 U$5.1VIN+
HV+UNFUSED
  Top 0.61: HV+UNFUSED.P$1 106.81,14.61 U$4.CONTACT1
  Top 0.813: C1.P$1 80.92,14.61 HV+UNFUSED.P$2 92.98,13.82 93.6,13.21 94.61,13.21 95.48,14.08 HV+UNFUSED.P$1
HV+UNFUSED_FSAE_DISCHARGE
  Top 0.61: DISCH+.P$1 92.6,69.23 93.22,69.85 94.23,69.85 95.1,68.98 DISCH+.P$2 104.85,68.58 U$4.CONTACT2
HV-FUSED_1A
  Top 0.61: HV-FUSED_1A-IMD-.P$1 HV-FUSED_1A-IMD-.P$3 HV-FUSED_1A-IMD-.P$4
  Top 0.813: U$5.4VIN- 92.81,22.89 88.43,22.89 79.12,32.19 79.12,64.01 76.58,66.55 HV-FUSED_1A-IMD-.P$2 HV-FUSED_1A-IMD-.P$4
HV-UNFUSED
  Top 0.61: HV-UNFUSED_DISCHARGE-.P$1 HV-UNFUSED_DISCHARGE-.P$3 HV-UNFUSED_DISCHARGE-.P$4 HV-UNFUSED_DISCHARGE-.P$2
  Top 0.813: C1.P$2 67.69,17.83 67.69,64.24 HV-UNFUSED_DISCHARGE-.P$2
IM  (via drill 0.38)
  Top 0.254: v10.92,55.12 10.92,62.36 11.27,62.71 U$2.P$10
  Bottom 0.254: v10.92,55.12 11.18,54.86 R35.1 11.17,48.4 12.72,46.84 U$8.10
IP  (via drill 0.35)
  Top 0.254: U$2.P$12 v12.42,54.23
  Bottom 0.254: v12.42,54.23 13.18,53.47 13.18,51.31 R35.2 U$8.11
ISOSPI-M
  Top 0.254: ISO_SPI.P$2 R40.2 26.76,62.62 U$2.P$3
ISOSPI-P
  Top 0.254: ISO_SPI.P$1 33.02,66 33.02,61.97 31.62,60.57 R40.1 28.62,58.71 U$2.P$1
MISO  (via drill 0.38)
  Top 0.254: R37.2 31.82,5.77 31.81,5.77 | 25.27,9.53 U$6.12
  Top 0.305: 24.83,7.68 23.5,6.35 17.61,6.35 v16.76,7.2 | 24.83,7.68 25.15,8 25.15,9.4 25.27,9.53 | R37.2 31.34,5.83 30.72,6.46 26.05,6.46 24.83,7.68
  Top 0.406: 31.81,5.77 32.95,4.64 33.59,4.64 35.43,2.79 U$9.D12
  Bottom 0.254: v16.76,7.2 14.73,9.23 14.73,15.24 16.51,17.02
  Bottom 0.305: U$8.3 14.72,24.27 16.51,22.48 16.51,17.02
MOSI_5V  (via drill 0.35)
  Top 0.254: U$25.10 16.77,14.6 17.78,13.59 v20.83,13.59 | v20.83,11.81 20.83,7.11 21.08,6.86 23.37,6.86 24,7.49 U$6.11
  Bottom 0.254: v20.83,13.59 v20.83,11.81
MOSI_TEENSY  (via drill 0.35)
  Top 0.254: R36.2 29.58,5.71 16.51,5.71 16,6.22 16,7.74 16.77,8.51 | U$25.5 16.77,8.51 | v18.92,8 18.46,8 18.43,7.98 17.3,7.98 16.77,8.51
  Top 0.406: U$9.D11 31.24,4.57 30.35,4.57 29.84,5.08 R36.2
  Bottom 0.254: 15.22,24.64 19.12,20.74 19.12,16.69 20.07,15.75 20.07,12.63 19.12,11.68 19.12,8.83 19.09,8.8 19.09,8.17 v18.92,8
  Bottom 0.305: U$8.2 15.22,24.64
N$1  (via drill 0.38)
  Top 0.254: v32.13,21.46 31.75,21.08 31.75,15.49 31.24,14.99 30.73,14.99 U$6.1
  Bottom 0.254: v32.13,21.46 31.68,21.91 31.24,21.91 U$11.5
N$2
  Bottom 0.254: C6.1 25.26,29.02 27.05,27.24 U$11.1 27.3,26.29 29.84,23.75 U$11.6
N$3
  Top 0.406: R5.1 ON-LED.C
N$4
  Bottom 0.254: C7.1 25.53,23.56 27.05,22.04 U$11.8
N$7  (via drill 0.35)
  Top 0.254: U$25.13 14.82,14.66 v15.39,14.1 | v22.61,7.52 22.73,7.64 U$6.10
  Bottom 0.254: v15.39,14.1 15.39,9.76 18.36,6.78 21.87,6.78 v22.61,7.52
N$9
  Top 0.406: R6.2 R7.2 26.54,24.65 26.54,20.07 U$6.4
N$24  (via drill 0.38)
  Top 0.254: v28.7,11.94 24.64,11.94 24,12.57 U$6.6 | v34.51,12.71 35.66,13.86 45.96,13.86 49,16.89 49,32.41 42.55,38.86 v39.75,38.86
  Bottom 0.254: v28.7,11.94 28.96,11.68 33.48,11.68 v34.51,12.71 | v39.75,38.86 35.06,38.86 R1.2 R2.2
N$25  (via drill 0.4)
  Top 0.406: U$7.1 2.54,5.33 3.3,4.57 v3.81,4.57
  Bottom 0.406: v3.81,4.57 10.92,4.57 U$9.D3(CANTX)
N$26
  Top 0.406: R30.2 2.54,12.18 U$7.8
N$27
  Top 0.406: R28.1 C8.2
N$28
  Top 0.406: R29.1 C9.2
N$29
  Top 0.406: R31.1 41.11,5.69 LED.C
N$31
  Bottom 0.254: U$8.16 15.75,43.32 17.15,44.73 17.15,45.72 R33.1
N$32
  Bottom 0.254: U$8.15 15.24,43.3 15.24,45.58 R33.2
  Bottom 0.406: R34.1 R33.2
N$35  (via drill 0.38)
  Top 0.254: v14.61,59.69 13.59,60.71 U$2.P$11
  Bottom 0.254: v14.61,59.69 C4.1
N$36
  Top 0.406: U$9.D4(CANRX) 13.34,4.7 7.49,4.7 6.35,5.84 U$7.4
N$37  (via drill 0.38)
  Top 0.254: LED.A 38.85,5.84 v36.04,5.84
  Bottom 0.254: U$9.D7(RX3) 24.79,4.72 34.92,4.72 v36.04,5.84
N$38  (via drill 0.38)
  Top 0.254: v35.28,9.53 U$10.WDO
  Bottom 0.254: R38.2 43.91,7.48 45.19,8.76 45.19,10.41 44.55,11.05 U$3.2 41.88,11.05 40.36,9.53 v35.28,9.53
N$40  (via drill 0.38)
  Top 0.254: v33.27,8.38 v33.27,12.57
  Bottom 0.254: U$3.1 42.25,8.51 33.4,8.51 v33.27,8.38 | v33.27,12.57 33.27,13.97 30.48,16.76 U$9.A1
N$42  (via drill 0.38)
  Top 0.406: IMD-OK.A 20.54,46.13 19.81,46.86 v19.81,47.88
  Bottom 0.406: v19.81,47.88 20.89,47.88 IC2.1 IC2.2
N$43  (via drill 0.38)
  Top 0.406: BMS-OK.A 19.52,41.78 19.05,41.31 v19.05,41.27
  Bottom 0.406: IC2.6 IC2.7 22.35,41.78 21.59,41.02 19.3,41.02 v19.05,41.27
N$44
  Top 0.406: R4.1 BMS-OK.C
N$45
  Top 0.406: R3.2 IMD-OK.C
N$50  (via drill 0.38)
  Top 0.254: U$10.WDI 37.13,14.66 37.13,15.29 | U$9.A0 33.02,16.46 33.6,15.88 36.55,15.88 37.13,15.29 | 37.13,15.29 37.13,16.33 v37.31,16.51
  Bottom 0.254: R42.1 38.84,14.11 38.84,15.75 38.08,16.51 v37.31,16.51
OKHS  (via drill 0.35, 0.38)
  Top 0.254: R41.1 50.1,12.49 v47.98,14.61 | v24.89,21.34 24,20.45 21.59,20.45 19.22,22.81 MAIN.P$5 | v16.85,38.32 17.91,39.37 17.91,44.96 19.05,46.1 19.18,46.1
  Top 0.305: IMD.P$5 15.96,30.76 15.96,26.63 v15.94,26.61 | 19.18,46.1 v19.18,46.16
  Bottom 0.254: v47.98,14.61 47.92,14.61 42.08,20.45 26.8,20.45 25.91,21.34 v24.89,21.34 | 23.62,46.86 IC2.3 | v15.94,26.61 15.94,37.4 v16.85,38.32
  Bottom 0.305: v15.94,26.61 15.94,26.1 19.18,22.86 MAIN.P$5 | v19.18,46.16 22.92,46.16 23.62,46.86
SCK_5V  (via drill 0.35)
  Top 0.254: U$25.11 16.12,14.32 v16.42,14.02 | v26.04,7.81 26.54,8.32 U$6.13
  Bottom 0.254: v26.04,7.81 25.59,8.26 22.4,8.26 21.34,7.19 18.59,7.19 16.42,9.36 v16.42,14.02
SCK_TEENSY  (via drill 0.35)
  Top 0.254: U$25.4 16.12,8.88 v15.01,7.77
  Bottom 0.254: v15.01,7.77 15.01,7.59 15.05,7.56 | 30.1,10.92 26.33,7.15 23.81,7.15 23.01,6.35
  Bottom 0.305: U$8.4 14.22,8.38 15.05,7.56 16.26,6.35 23.01,6.35 | 30.1,10.92 34.01,10.92 35.53,12.45 35.53,18.01 U$9.D13
SHUTDOWN6
  Bottom 0.406: INTERLOCK.P$1 25.8,34.29 24.32,32.81 MAIN.P$6
SHUTDOWN7  (via drill 0.38)
  Top 0.406: 37.09,36.06 38.73,37.7 D1.A | 37.09,36.06 RELAYS.P$1 | R6.1 28.94,27.66 28.94,30.67 30.4,32.13 30.4,33.84 29.95,34.29 INTERLOCK.P$2 | v42.42,30.1 42.42,32.51 38.87,36.06 37.09,36.06
  Bottom 0.305: U$4.COIL+ 107.22,40.61 116.65,31.18 116.65,4.12 114.3,1.78 55.37,1.78 52.68,4.47 52.68,19.84 v42.42,30.1
  Bottom 0.406: RELAYS.P$1 33.73,34.29 | 33.73,34.29 INTERLOCK.P$2 | D2.C 33.73,32.63 33.73,34.29
SHUTDOWN7_EXT_OUT
  Bottom 0.254: R1.1 29.46,39.5 D1.C
  Bottom 0.406: D1.C 27.05,40.39 22.26,35.59 18.91,35.59 17.92,34.6 17.92,31.64 19.21,30.35 MAIN.P$2
TEMP_SENSE
  Top 0.254: CURRENT.P$3 37.42,25.82 36.7,26.54 33.59,26.54 29.08,22.04 U$6.2
TSAL+
  Bottom 0.406: MAIN.P$1 19.18,33.91 20.3,35.03 22.62,35.03 22.63,35.05 23.88,35.05 26.67,37.85 40.13,37.85 41.78,39.5 41.78,44.96 U$5.6SENSE+ U$5.5VOUT+

### Text on the board
tDocu: TS | GLV | GLV | TS | isoSPI | GLV | GLV | isoSPI | UNFUSED- | FUSED- | FUSED+ | DISCHARGE- | IMD- | IMD+ | isoSPI | GLV | DANGER / HIGH VOLTAGE | TS | GLV | GLV | TS | TRACTIVE SYSTEM / PCB AREA | TS | GLV | IMD | GLV | GLV | TS | TS | TS | GLV | STWD100 | UNFUSED+ | Grounded Low / Voltage PCB Area | TEENSY | 2019 HV_board_rev10 / Designed by Yvonne Yeh
bDocu: TS | GLV | GLV | TS | isoSPI | GLV | GLV | isoSPI | isoSPI | GLV | DANGER / HIGH VOLTAGE | TS | GLV | GLV | TS | LTC6820 | TRACTIVE SYSTEM / PCB AREA | TS | GLV | GLV | GLV | TS | TS | TS | GLV | SN74LVC1G08 | Grounded Low / Voltage PCB Area
200bmp: C:/Users/yyeh8/Documents/GitHub/circuits-2019/EAGLE Supporting Files/Bitmaps for logos/HyTech_square.bmp | C:/Users/yyeh8/Documents/GitHub/circuits-2019/EAGLE Supporting Files/Bitmaps for logos/HyTech_square.bmp